# EAGLE design Zirkulation (EAGLE 9.6.2)
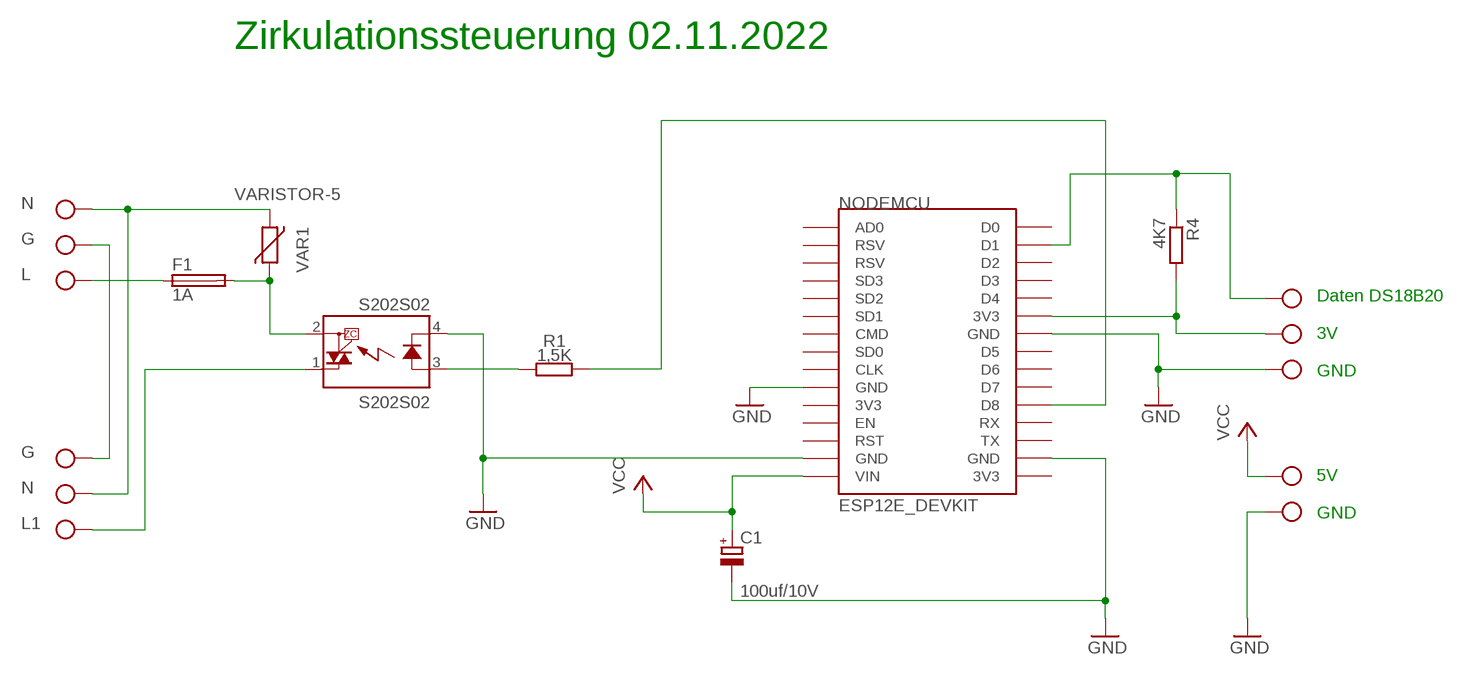
[diagram p0: schematic, sheet 1]

## Parts
C1  100uf/10V  CPOL-EUE2.5-7  [E2,5-7]
F1  1A  FUSESH22,5  [SH22,5]
IN  MKDSN1,5/3-5,08  [MKDSN1,5/3-5,08]
NODEMCU  ESP12E_DEVKIT  [ESP12E_DEVKIT]
OUT  MKDSN1,5/3-5,08  [MKDSN1,5/3-5,08]
PWR  MKDSN1,5/2-5,08  [MKDSN1,5/2-5,08]
R1  1,5K  R-EU_0204/5  [0204/5]
R4  4K7  R-EU_0204/5  [0204/5]
S202S02  S202S02  [S202S02]
SENSOR  MKDSN1,5/3-5,08  [MKDSN1,5/3-5,08]
VAR1  VARISTOR-5  [R-5]

## Nets
G [230V]: IN.3 OUT.3
GND: C1.- NODEMCU.GND@0(GND) NODEMCU.GND@1(GND) NODEMCU.GND@2(GND) NODEMCU.GND@3(GND) PWR.2 S202S02.4(K) SENSOR.3
L [230V]: F1.1 IN.1
L1 [230V]: OUT.1 S202S02.1(DS1)
LF [230V]: F1.2 S202S02.2(DS2) VAR1.1
N [230V]: IN.2 OUT.2 VAR1.2
N$2: R1.2 S202S02.3(A)
N$5: NODEMCU.D8 R1.1
N$6: NODEMCU.3V3@1(3V3) R4.2 SENSOR.2
N$7: NODEMCU.D1 R4.1 SENSOR.1
VCC: C1.+ NODEMCU.VIN PWR.1
Unconnected: NODEMCU.3V3@0(3V3) NODEMCU.3V3@2(3V3) NODEMCU.AD0 NODEMCU.CLK NODEMCU.CMD NODEMCU.D0 NODEMCU.D2 NODEMCU.D3 NODEMCU.D4 NODEMCU.D5 NODEMCU.D6 NODEMCU.D7 NODEMCU.EN NODEMCU.RST NODEMCU.RSV@0(RSV) NODEMCU.RSV@1(RSV) NODEMCU.RX NODEMCU.SD0 NODEMCU.SD1 NODEMCU.SD2 NODEMCU.SD3 NODEMCU.TX

## Notes on the sheet
- Zirkulationssteuerung 02.11.2022
- Daten DS18B20
  
  3V
  
  GND
- 5V
  
  GND

## Library data of the parts
C1 = my_rcl:CPOL-EU: POLARIZED CAPACITOR, European symbol; SPICEPREFIX: C
F1 = my_fuse:FUSE: Fuse; OC_FARNELL: unknown; OC_NEWARK: unknown
IN OUT SENSOR = my_con-phoenix-508:MKDSN1,5/3-5,08: MKDSN 1,5/ 3-5,08 Printklemme Nennstrom: 13,5 A Nennspannung: 250 V Rastermaß: 5,08 mm Polzahl: 3 Anschlussart: Schraubanschluss Montage: Löten Anschlussrichtung Leiter/Platine: 0 ° Artikelnummer: 1729131 Source: http://eshop.phoenixcontact.com .. 1729131.pdf
NODEMCU = ESP12E_DEVKIT:ESP12E_DEVKIT: ESP12E DEVKIT BOARD
PWR = my_con-phoenix-508:MKDSN1,5/2-5,08: MKDSN 1,5/ 2-5,08 Printklemme Nennstrom: 13,5 A Nennspannung: 250 V Rastermaß: 5,08 mm Polzahl: 2 Anschlussart: Schraubanschluss Montage: Löten Anschlussrichtung Leiter/Platine: 0 ° Artikelnummer: 1729128 Source: http://eshop.phoenixcontact.com .. 1729128.pdf
R1 R4 = my_rcl:R-EU_: RESISTOR, European symbol; SPICEPREFIX: R
S202S02 = my_relay:S*02S02: IT(rms) 8A, Zero Cross type SIP 4pin Triac output SSR Source: http://sharp-world.com/products/device/lineup/data/pdf/datasheet/s102s02_e.pdf; MPN: S202S02F; OC_FARNELL: 1618475; OC_NEWARK: 14N9588
VAR1 = my_varistor:VARISTOR: VARISTOR

## Net classes
0 default: width 0.305 mm
1 230V: width 1.016 mm, clearance 1.5 mm

## Board
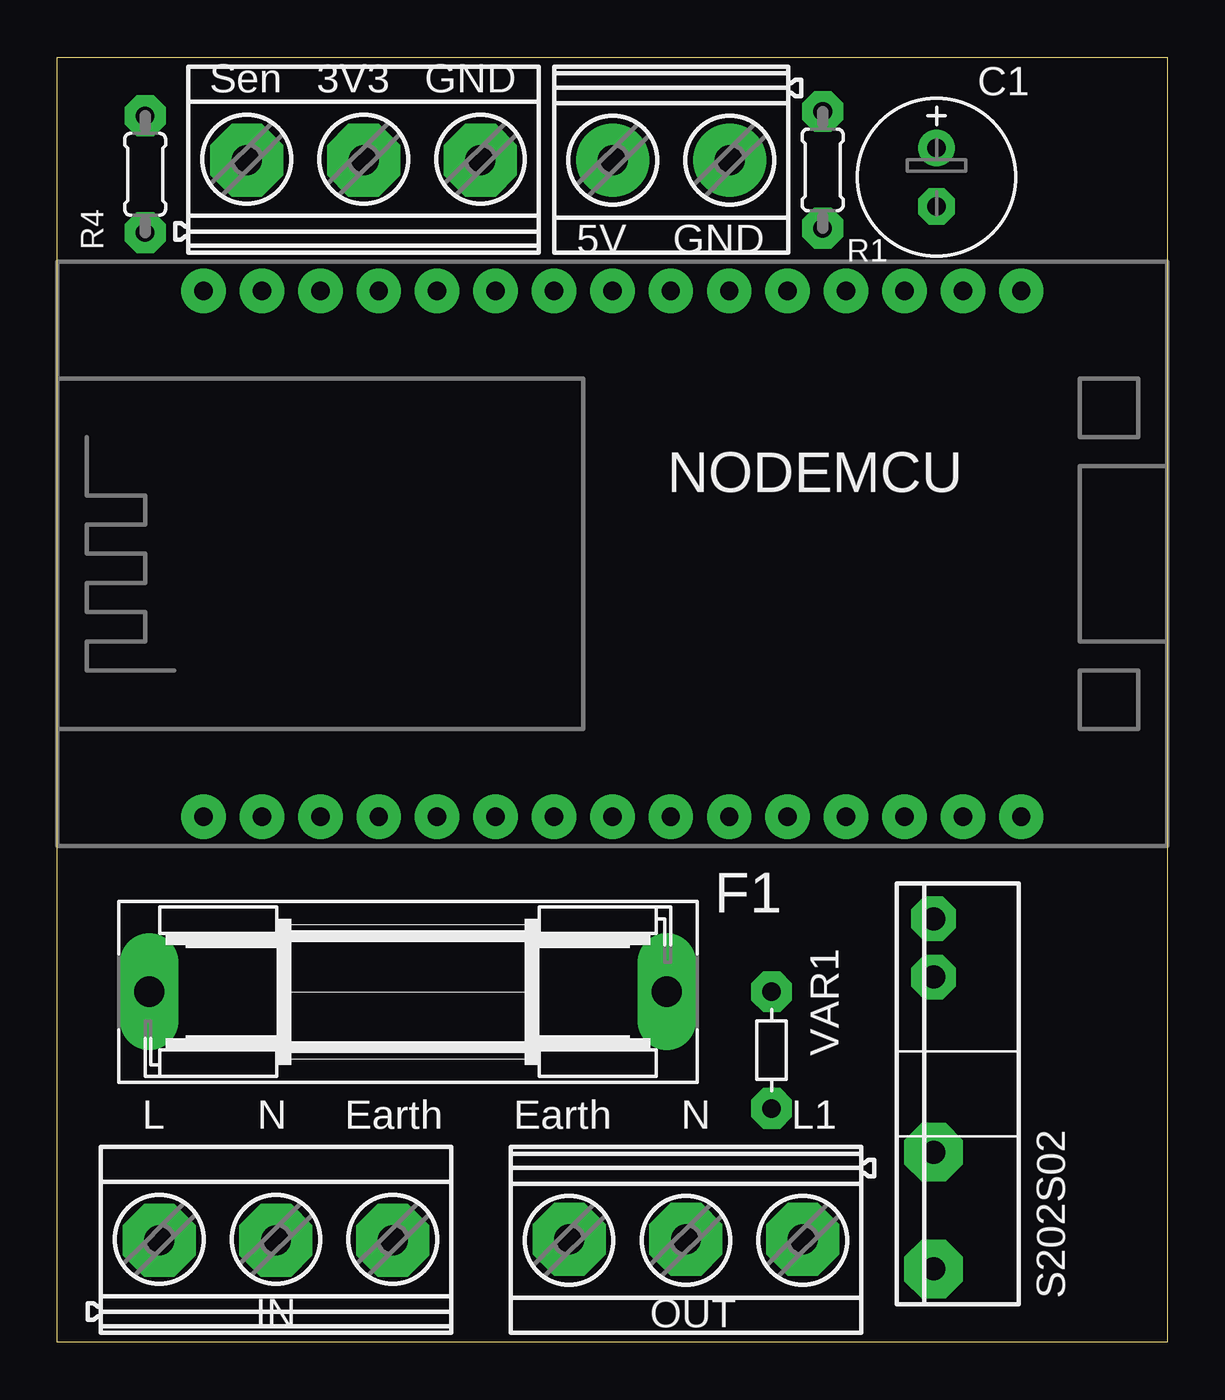
[diagram p1: board, top side]
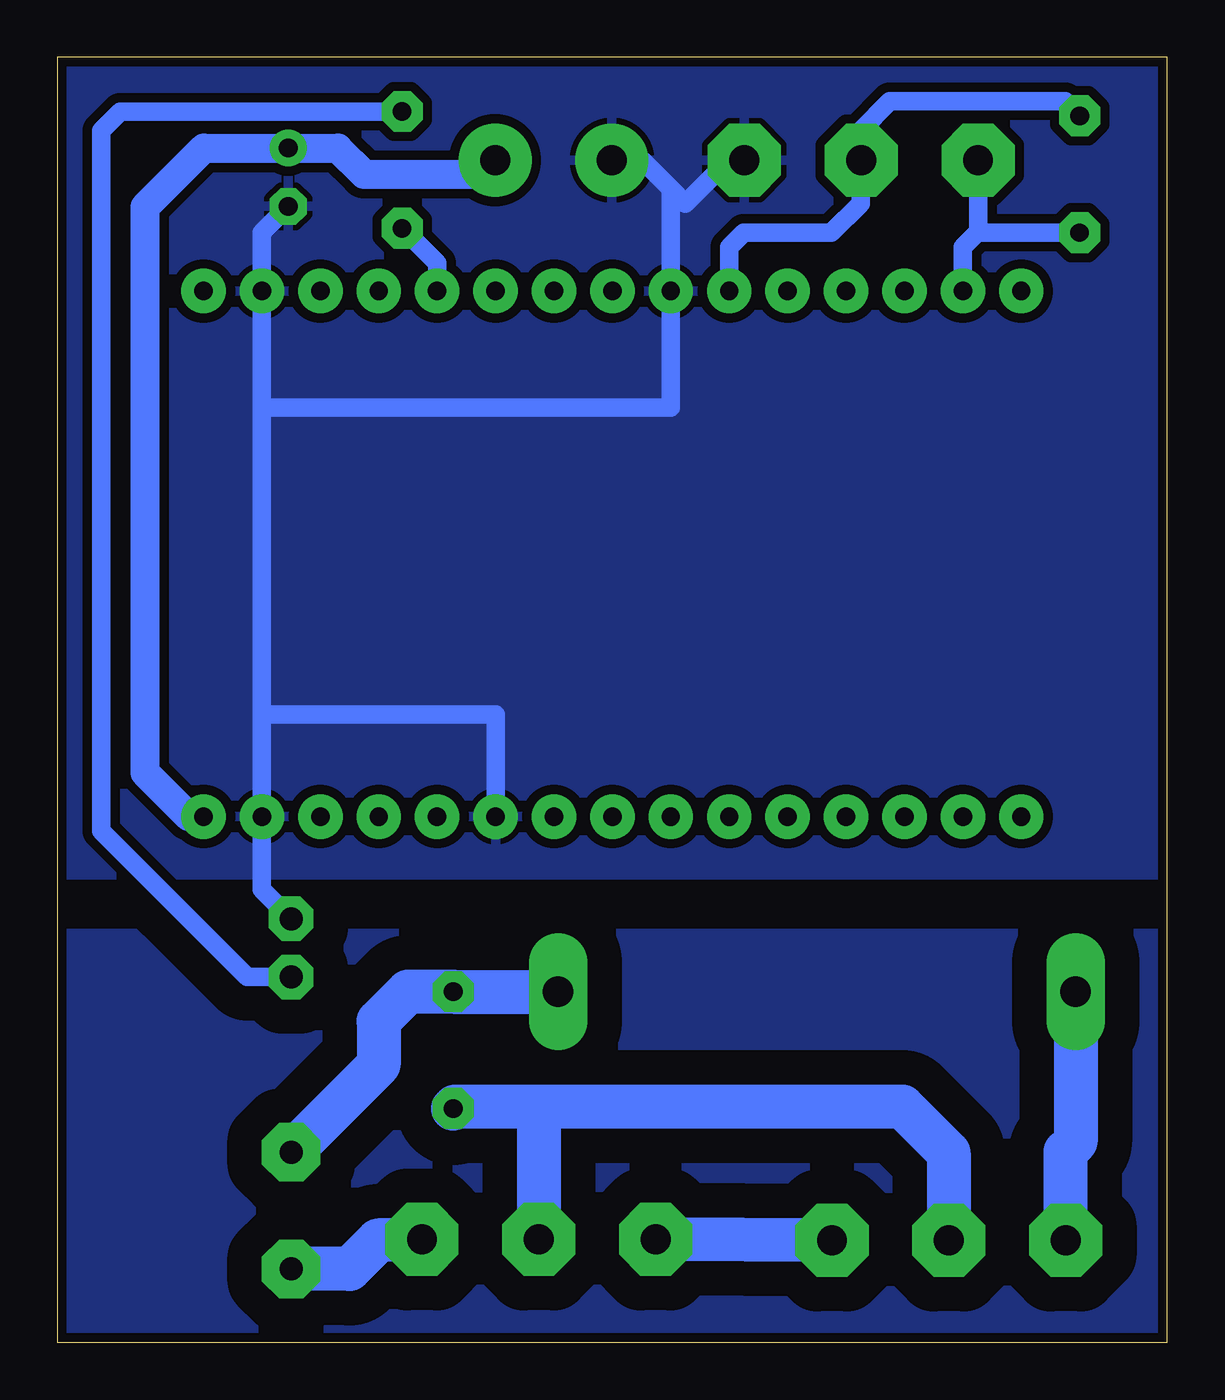
[diagram p2: board, bottom side, seen from below]

Size 48.26 x 55.88 mm. Coordinates in mm from the lower left corner, seen from the top.
Outline: 0,0 0,55.88 48.26,55.88 48.26,0 0,0
Copper layers (1*16): Top 0.035mm / dielectric 1.5mm / Bottom 0.035mm
Design rules "aisler_2_layer_simple": minimum track width 0.2mm, minimum drill 0.45mm, track to track 0.175mm, track to pad 0.175mm, pad to pad 0.175mm, via to via 0.175mm, smd to smd 0.175mm, copper to edge 0.3mm, drill to drill 0.25mm, minimum pad ring 0.2mm, minimum via ring 0.2mm, stop-mask expansion 0mil, vias tented up to drill 0mil, thermal gap 10mil

### Footprints (pad centres in the part's own frame; a part is rotated, then mirrored left to right if it is on the bottom)
E2,5-7 = drill 0.813 pad 1.6: + -1.27,0 | drill 0.813 pad 1.6 octagon: - 1.27,0
SH22,5 = drill 1.321 pad 2.54 long: 1 -11.252,0; 2 11.252,0
MKDSN1,5/3-5,08 = drill 1.3 pad 3.175 octagon: 1 -7.645,-0.021; 2 -2.565,-0.021; 3 2.515,-0.021
ESP12E_DEVKIT = drill 0.8 pad 1.93: 3V3@0 -11.43,-7.62; 3V3@1 11.43,5.08; 3V3@2 11.43,-17.78; AD0 -11.43,17.78; CLK -11.43,-2.54; CMD -11.43,2.54; D0 11.43,17.78; D1 11.43,15.24; D2 11.43,12.7; D3 11.43,10.16; D4 11.43,7.62; D5 11.43,0; D6 11.43,-2.54; D7 11.43,-5.08; D8 11.43,-7.62; EN -11.43,-10.16; GND@0 -11.43,-5.08; GND@1 -11.43,-15.24; GND@2 11.43,2.54; GND@3 11.43,-15.24; RST -11.43,-12.7; RSV@0 -11.43,15.24; RSV@1 -11.43,12.7; RX 11.43,-10.16; SD0 -11.43,0; SD1 -11.43,5.08; SD2 -11.43,7.62; SD3 -11.43,10.16; TX 11.43,-12.7; VIN -11.43,-17.78
MKDSN1,5/2-5,08 = drill 1.3 pad 3.175: 1 -2.561,0.025; 2 2.519,0.025
0204/5 = drill 0.8 pad 1.778 octagon: 1 -2.54,0 | drill 0.813 pad 1.778 octagon: 2 2.54,0
S202S02 = drill 1 pad 2.54 octagon: 1 -7.62,0; 2 -2.54,0 | drill 1 pad 1.93 octagon: 3 5.08,0; 4 7.62,0
R-5 = drill 0.813 pad 1.778 octagon: 1 -2.54,0; 2 2.54,0

### Placement (x,y rotation side)
C1  38.23,50.67 270 top
F1  15.24,15.24 0 top
IN  12.06,4.45 0 top
NODEMCU  24.13,34.29 90 top
OUT  24.77,4.45 180 top
PWR  26.67,51.44 180 top
R1  33.27,50.99 90 top
R4  3.81,50.8 90 top
S202S02  38.1,10.79 90 top
SENSOR  15.88,51.44 0 top
VAR1  31.05,12.7 270 top

### Tracks (layer width: path | path; a pad name or v marks a point on that pad's centre or on a via)
COPPER
  pour Bottom (isolate 0.406): 0,0 48.26,0 48.26,17.78 0,17.78
G
  Bottom 1.27: 22.2,4.47 OUT.3
  Bottom 1.905: IN.3 22.2,4.47
GND
  Bottom 0.813: C1.- 39.37,48.26 NODEMCU.GND@3 39.37,40.64 | S202S02.4 39.37,19.68 NODEMCU.GND@1 39.37,27.3 | 39.37,40.64 21.59,40.64 NODEMCU.GND@2 21.59,50.16 | SENSOR.3 19.07,51.41 20.95,49.53 21.59,50.16 | 39.37,27.3 39.37,40.64 | NODEMCU.GND@0 29.21,27.3 39.37,27.3 | PWR.2 22.84,51.41 21.59,50.16
  pour Bottom (isolate 0.406): 0,55.88 0,20.32 48.26,20.32 48.26,55.88
L
  Bottom 1.905: IN.1 4.42,8.28 3.99,8.71 F1.1
L1
  Bottom 1.905: OUT.1 34.31,4.42 35.56,3.17 S202S02.1
LF
  Bottom 1.905: S202S02.2 34.29,12.06 34.29,13.97 33.02,15.24 VAR1.1 F1.2
N
  Bottom 1.905: IN.2 9.51,8.24 11.52,10.25 27.3,10.25 | VAR1.2 30.96,10.25 27.3,10.25 | OUT.2 27.3,4.49 27.3,10.25
N$2
  Bottom 0.813: S202S02.3 40.01,15.88 46.35,22.23 46.35,52.7 45.53,53.53 R1.2
N$5
  Bottom 0.813: R1.1 31.75,46.93 NODEMCU.D8
N$6
  Bottom 0.813: 13.34,51.44 SENSOR.2 | R4.2 4.45,53.98 12.06,53.98 13.34,52.7 13.34,51.44 | NODEMCU.3V3@1 19.05,47.62 18.41,48.26 14.61,48.26 13.34,49.53 13.34,51.44
N$7
  Bottom 0.813: 8.26,48.26 R4.1 6.35,48.26 | 8.26,48.26 8.89,47.62 NODEMCU.D1 | 8.26,48.26 8.23,48.28 SENSOR.1
VCC
  Bottom 0.813: 42.55,22.86 NODEMCU.VIN
  Bottom 1.27: 42.55,22.86 44.45,24.77 44.45,49.38 41.89,51.94 C1.+ 36.07,51.94 34.92,50.8 29.84,50.8 PWR.1

### Text on the board
tNames: Sen 3V3 GND | 5V GND | L N Earth | Earth N L1